# EAGLE design sx-wdec84-1.1 (EAGLE 7.4.0)
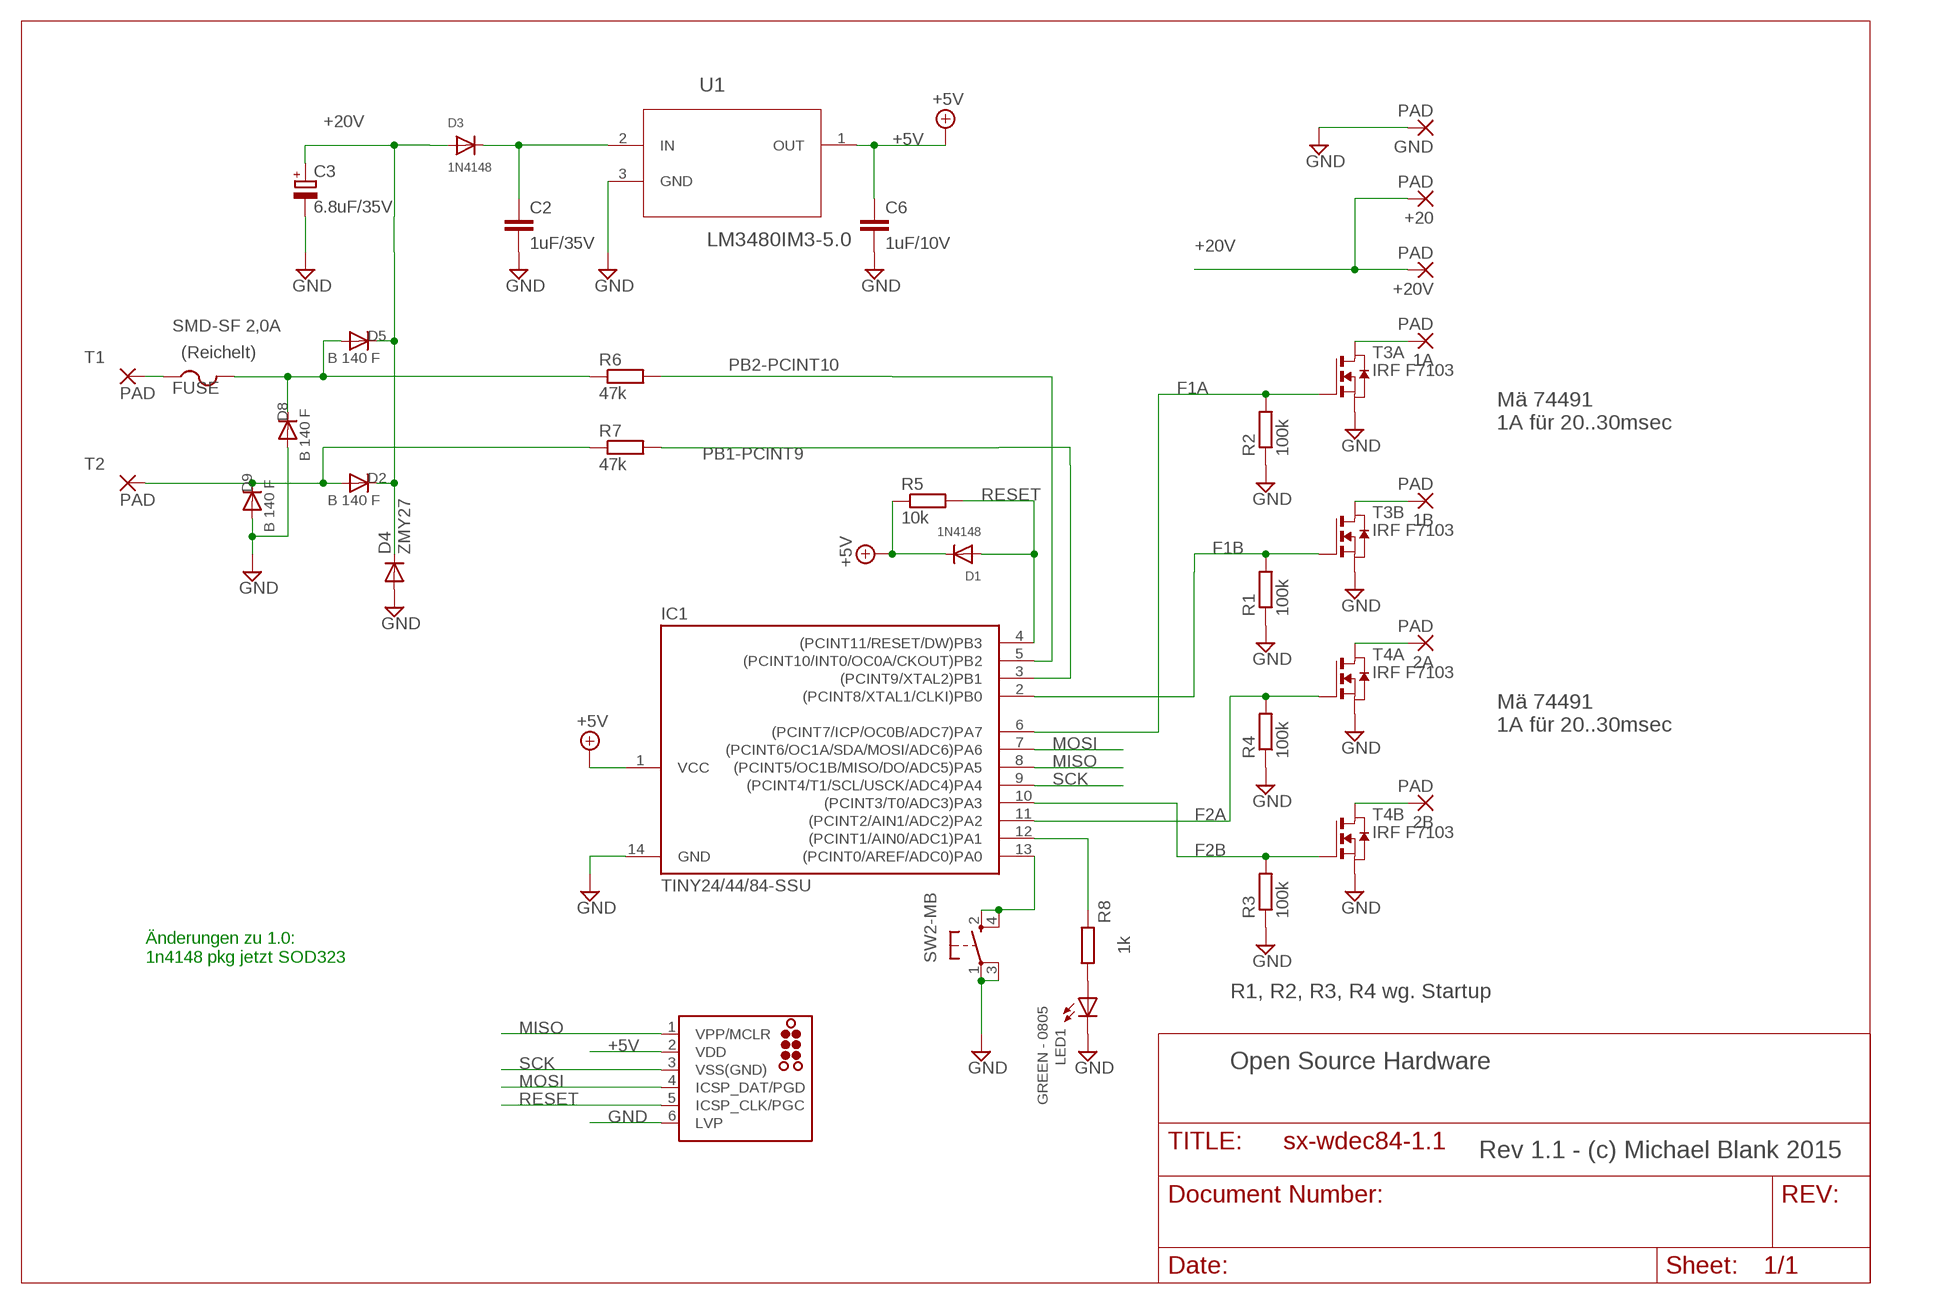
[diagram p0: schematic, sheet 1]

## Parts
1A  PAD  SMD2  [SMD1,27-2,54]
1B  PAD  SMD2  [SMD1,27-2,54]
2A  PAD  SMD2  [SMD1,27-2,54]
2B  PAD  SMD2  [SMD1,27-2,54]
+20  PAD  SMD2  [SMD1,27-2,54]
+20V  PAD  SMD2  [SMD1,27-2,54]
C2  1uF/35V  C-EUC0805  [C0805]
C3  6.8uF/35V  CPOL-EUSMCD  [SMC_D]
C6  1uF/10V  C-EUC0805  [C0805]
D1  1N4148  DIODESOD-323F  [SOD-323F]
D2  B 140 F  DIODESMA-403D  [SMA-403D]
D3  1N4148  DIODESOD-323F  [SOD-323F]
D4  ZMY27  DIODE-MELF-MLL41  [MELF-MLL41]
D5  B 140 F  DIODESMA-403D  [SMA-403D]
D8  B 140 F  DIODESMA-403D  [SMA-403D]
D9  B 140 F  DIODESMA-403D  [SMA-403D]
FUSE  SMD-SF 2,0A  PTCFUSE-1812  [1812]
GND  PAD  SMD2  [SMD1,27-2,54]
IC1  TINY24/44/84-SSU  [SOIC14]
J1  ISP  TC2030-MCP-NL  [TC2030-MCP-NL]
LED1  GREEN - 0805  LED0805  [LED-0805]
R1  100k  R-EU_R0805W  [R0805W]
R2  100k  R-EU_R0805W  [R0805W]
R3  100k  R-EU_R0805W  [R0805W]
R4  100k  R-EU_R0805W  [R0805W]
R5  10k  R-EU_R0805W  [R0805W]
R6  47k  R-EU_R0805W  [R0805W]
R7  47k  R-EU_R0805W  [R0805W]
R8  1k  R-EU_R0805W  [R0805W]
SW2-MB  SPST_TACT-KMR2  [KMR2]
T1  PAD  SMD2  [SMD1,27-2,54]
T2  PAD  SMD2  [SMD1,27-2,54]
T3  IRF F7103  DMN3024LSD  [SO8]
T4  IRF F7103  DMN3024LSD  [SO8]
U1  LM3480IM3-5.0  [SOT95P263X110-3N]

## Nets
+5V: C6.1 D1.C IC1.1(VCC) J1.2(VDD) R5.1 U1.1(OUT)
+20V: +20.1(P) +20V.1(P) C3.+ D2.C D3.A D4.C D5.C
F1A: IC1.6((PCINT7/ICP/OC0B/ADC7)PA7) R2.2 T3.2(A:G)
F1B: IC1.2((PCINT8/XTAL1/CLKI)PB0) R1.2 T3.4(B:G)
F2A: IC1.11((PCINT2/AIN1/ADC2)PA2) R4.2 T4.2(A:G)
F2B: IC1.10((PCINT3/T0/ADC3)PA3) R3.2 T4.4(B:G)
GND: C2.2 C3.- C6.2 D4.A D8.A D9.A GND.1(P) IC1.14(GND) J1.6(LVP) LED1.C R1.1 R2.1 R3.1 R4.1 SW2-MB.1(P) SW2-MB.3(P1) T3.1(A:S) T3.3(B:S) T4.1(A:S) T4.3(B:S) U1.3(GND)
MISO: IC1.8((PCINT5/OC1B/MISO/DO/ADC5)PA5) J1.1(VPP/MCLR)
MOSI: IC1.7((PCINT6/OC1A/SDA/MOSI/ADC6)PA6) J1.4(ICSP_DAT/PGD)
N$1: 2B.1(P) T4.5(B:D) T4.6(B:D)
N$2: 2A.1(P) T4.7(A:D) T4.8(A:D)
N$3: FUSE.1 T1.1(P)
N$5: D5.A D8.C FUSE.2 R6.1
N$6: IC1.13((PCINT0/AREF/ADC0)PA0) SW2-MB.2(S) SW2-MB.4(S1)
N$7: C2.1 D3.C U1.2(IN)
N$8: 1B.1(P) T3.5(B:D) T3.6(B:D)
N$9: LED1.A R8.2
N$10: 1A.1(P) T3.7(A:D) T3.8(A:D)
N$12: IC1.12((PCINT1/AIN0/ADC1)PA1) R8.1
PB1-PCINT9: IC1.3((PCINT9/XTAL2)PB1) R7.2
PB2-PCINT10: IC1.5((PCINT10/INT0/OC0A/CKOUT)PB2) R6.2
RESET: D1.A IC1.4((PCINT11/RESET/DW)PB3) J1.5(ICSP_CLK/PGC) R5.2
SCK: IC1.9((PCINT4/T1/SCL/USCK/ADC4)PA4) J1.3(VSS(GND))
TR-L: D2.A D9.C R7.1 T2.1(P)

## Notes on the sheet
- (Reichelt)
- Mä 74491
  1A für 20..30msec
- Mä 74491
  1A für 20..30msec
- Änderungen zu 1.0:
  1n4148 pkg jetzt SOD323
- R1, R2, R3, R4 wg. Startup
- Open Source Hardware
- Rev 1.1 - (c) Michael Blank 2015

## Library data of the parts
1A 1B 2A 2B +20 +20V GND T1 T2 = wirepad:SMD2: SMD PAD
C2 C6 = rcl:C-EU: CAPACITOR, European symbol
C3 = resistor:CPOL-EU: POLARIZED CAPACITOR, European symbol
D1 D3 = adafruit:DIODE: Diode SMADIODE - SMA Surface Mount Package 20V 1A Schottky Diode Digikey: 641-1014-6-ND DO-1N4148 - Through Hole Small Current Diode SOD-123 20V 1 A (.5mV Vf) Schottky Diode - Digikey: MBRX120TPMSCT-ND SOD-323 10V 570mA (.38mV Vf, 3ns) Schottky Diode - Digikey: ZLLS410CT-ND SOD-523 30V 30mA Schottky Diode (RB751S-40TE61) - Digikey: RB751S-40TE61CT-ND SOT23-R/W - SOT23 Package (R = Solder Paste/Reflow Ovens, W = Hand-Soldering) BAT54Film 40V 300mA - Digikey: 497-7162-1-ND
D2 D5 D8 D9 = Ai_DiscreteSemis:DIODE
D4 = diode:DIODE-: DIODE
FUSE = adafruit:PTCFUSE: PTC fuses, resettable thermistors
IC1 = avr-7:TINY24/44/84
J1 = tag-connect:TC2030: TAG-CONNECT ICSP Connector Manufacturer: Tag-Connect <http://www.tag-connect.com> Cable for easy In-Circuit Serial Programming. Designed for Microchip ICD2, suitable for many others. Two variants - one "with legs" (for hands-free fit on PCB) and another "without legs" for quick programming. PAD Description 1 MCLR/Vpp 2 Vdd 3 GND 4 PGD (ISPDAT) 5 PGC (ISPCLK) 6 nc (used for LVP) ©2009 ROFA.cz - modified and updated by Robert Darlington ‹rdarlington@gmail.com›
LED1 = Ai_LED:LED
R1-R8 = rcl:R-EU_: RESISTOR, European symbol
SW2-MB = adafruit_MB:SPST_TACT: SMT 6mm switch, EVQQ2 series http://www.ladyada.net/library/eagle
T3 T4 = zetex:DMN3024LSD: 30V DUAL N-CHANNEL ENHANCEMENT MODE MOSFET Source: Data sheet <http://www.diodes.com/datasheets/DMN3024LSD.pdf>; OC_FARNELL: unknown; OC_NEWARK: unknown
U1 = lm3480:LM3480IM3-5.0: Linear Voltage Regulator; MPN: LM3480IM3-50; OC_FARNELL: 3160634; OC_NEWARK: 83F3816; PACKAGE: SOT-23-3; SUPPLIER: National Semiconductors

## Board
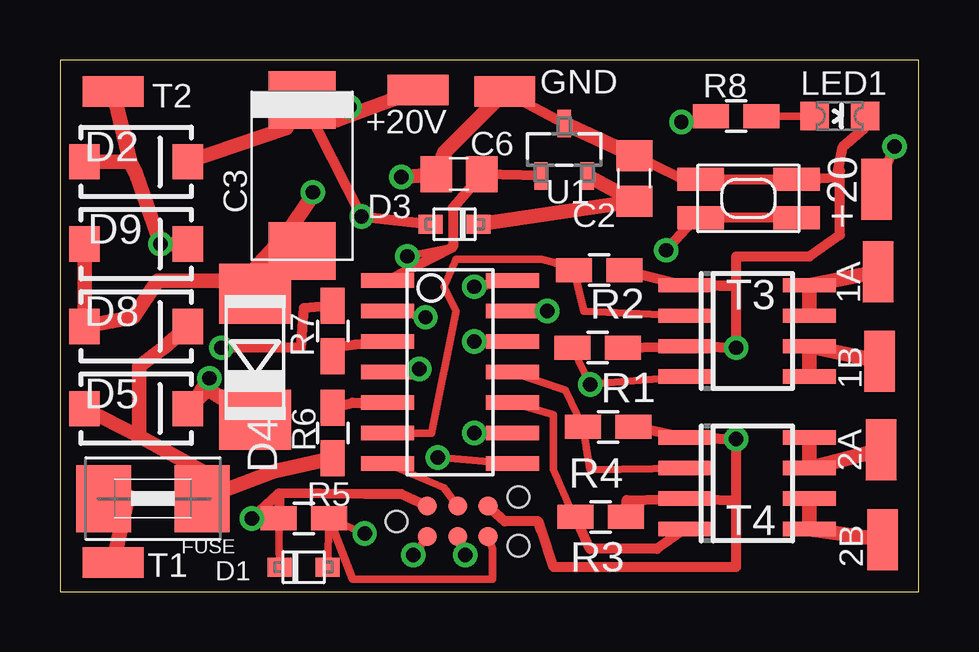
[diagram p1: board, top side]
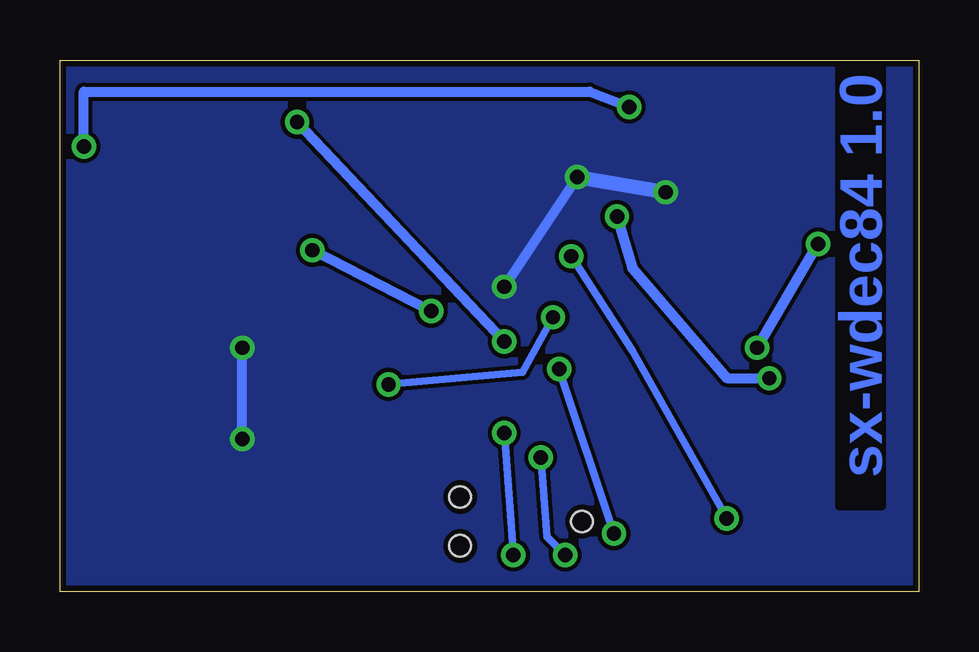
[diagram p2: board, bottom side, seen from below]

Size 35.79 x 22.15 mm. Coordinates in mm from the lower left corner, seen from the top.
Outline: 0,0 35.79,0 35.79,22.15 0,22.15 0,0
Copper layers (1*16): Top 0.035mm / dielectric 1.55mm / Bottom 0.035mm
Design rules "eC_2Layer_PClass6_BaseCopperO35": minimum track width 0.15mm, minimum drill 0.35mm, track to track 0.175mm, track to pad 0.175mm, pad to pad 0.175mm, via to via 0.175mm, smd to smd 0mil, copper to edge 0.25mm, drill to drill 0.35mm, minimum pad ring 0.175mm, minimum via ring 0.125mm, stop-mask expansion 0mil, vias tented up to drill 0.45mm, thermal gap 0.2mm

### Footprints (pad centres in the part's own frame; a part is rotated, then mirrored left to right if it is on the bottom)
SMD1,27-2,54 = smd 1.27 x 2.54: 1 0,0
C0805 = smd 1.3 x 1.5: 1 -0.95,0; 2 0.95,0
SMC_D = smd 2.4 x 2.8: + -3.15,0; - 3.15,0
SOD-323F = smd 1 x 0.8: A -1,0; C 1,0
SMA-403D = smd 1.27 x 1.47: A -2.15,0; C 2.15,0
MELF-MLL41 = smd 2.5 x 3: A 2.625,0; C -2.625,0
1812 = smd 2.286 x 2.794: 1 -2.046,0; 2 2.046,0
SOIC14 = smd 0.61 x 2.21: 1 -3.81,-2.603; 2 -2.54,-2.603; 3 -1.27,-2.603; 4 0,-2.603; 5 1.27,-2.603; 6 2.54,-2.603; 7 3.81,-2.603; 8 3.81,2.603; 9 2.54,2.603; 10 1.27,2.603; 11 0,2.603; 12 -1.27,2.603; 13 -2.54,2.603; 14 -3.81,2.603
TC2030-MCP-NL = smd 0.787 x 0.787: 1 1.27,-0.635; 2 1.27,0.635; 3 2.54,-0.635; 4 2.54,0.635; 5 3.81,-0.635; 6 3.81,0.635 | hole 0.889: 0,0; 5.08,-1.016; 5.08,1.016
LED-0805 = smd 1.2 x 1.2: A 0,-1.05; C 0,1.05
R0805W = smd 1.5 x 1: 1 -1.052,0; 2 1.052,0
KMR2 = smd 1.93 x 0.965: 1 2,0.8; 2 2,-0.8; 3 -2,0.8; 4 -2,-0.8
SO8 = smd 0.6 x 2.2: 1 -1.905,-2.6; 2 -0.635,-2.6; 3 0.635,-2.6; 4 1.905,-2.6; 5 1.905,2.6; 6 0.635,2.6; 7 -0.635,2.6; 8 -1.905,2.6
SOT95P263X110-3N = smd 0.559 x 1.143: 1 -0.965,-1.092; 2 0.965,-1.092; 3 0,1.092

### Placement (x,y rotation side)
1A  34.1,13.34 180 top
1B  34.16,9.59 180 top
2A  34.23,5.91 0 top
2B  34.29,2.16 0 top
+20  34.04,16.76 0 top
+20V  14.92,20.89 90 top
C2  23.94,17.21 90 top
C3  10.1,17.34 270 top
C6  16.64,17.4 180 top
D1  10.16,1.02 180 top
D2  3.18,17.91 0 top
D3  16.45,15.3 0 top
D4  8.13,9.78 90 top
D5  3.18,7.62 0 top
D8  3.18,11.05 0 top
D9  3.18,14.48 0 top
FUSE  3.87,3.87 0 top
GND  18.54,20.83 270 top
IC1  16.26,9.14 270 top
J1  14.03,2.92 0 top
LED1  32.51,19.81 270 top
R1  22.42,10.16 180 top
R2  22.48,13.4 180 top
R3  22.54,3.11 180 top
R4  22.86,6.86 180 top
R5  10.16,3.05 0 top
R6  11.37,6.6 90 top
R7  11.37,10.86 270 top
R8  28.19,19.81 0 top
SW2-MB  28.7,16.38 0 top
T1  2.22,1.21 90 top
T2  2.22,20.83 90 top
T3  28.64,10.86 270 top
T4  28.64,4.51 270 top
U1  21.02,18.41 0 top

### Tracks (layer width: path | path; a pad name or v marks a point on that pad's centre or on a via)
+5V  (via drill 0.6 pad 1.02)
  Top 0.305: 16.38,14.35 v14.48,13.97 | R5.1 D1.C
  Top 0.406: U1.1 C6.1 16.38,16 16.38,14.35 IC1.1 | J1.2 14.22,4.06 12.7,4.06 9.13,4.09 | 9.13,4.09 9.14,4.06 R5.1 | v8,3.05 9.13,4.09
  Bottom 0.305: v14.48,13.97 11.94,10.03 v8,3.05
+20V  (via drill 0.6 pad 1.02)
  Top 0.406: C3.+ v12.57,15.62 | v12.57,15.62 D3.A v12.57,15.62 | v6.22,8.89 6.1,8.89 D5.C | +20.1 v34.8,18.54 | v12.07,20.19 11.53,19.64
  Top 0.61: +20V.1 11.53,19.64 C3.+ 9.42,19.3 D2.C | D4.C 6.17,8.42 D5.C
  Bottom 0.406: v12.57,15.62 11.94,13.46 8,8.89 v6.22,8.89 | v34.8,18.54 34.8,20.83 13.72,20.83 v12.07,20.19
F1A
  Top 0.305: IC1.6 15.49,6.6 16.51,11.68 16,12.7 16.51,13.84 16.89,13.84 20.07,13.84 20.57,13.72 R2.2 21.84,11.68 T3.2
F1B  (via drill 0.6 pad 1.02)
  Top 0.305: IC1.2 v15.24,11.43 | R1.2 v22.1,8.64 T3.4
  Bottom 0.305: v15.24,11.43 16.51,9.14 v22.1,8.64
F2A
  Top 0.305: IC1.11 21.08,8.38 R4.2 22.1,5.08 T4.2
F2B
  Top 0.305: R3.2 21.34,3.3 20.57,5.08 20.57,7.37 IC1.10
  Top 0.406: T4.4 24.89,1.78 22.1,1.78 R3.2
GND  (via drill 0.6 pad 1.02)
  Top 0.406: J1.6 18.54,2.92 19.94,2.92 20.07,2.54 20.57,1.02 28.19,1.02 28.19,3.81 | R3.1 23.62,3.11 23.62,3.81 T4.3 28.19,3.81 | 28.19,3.81 v28.19,6.35 | v28.19,6.35 T4.1 | T4.1 R4.1 | T4.1 v28.19,6.35 | v28.19,10.16 T3.3 | T3.1 28.19,12.76 28.19,13.97 31.24,13.97 32.51,14.86 32.51,16.76 32.51,17.53 32.38,17.27 | T3.3 v28.19,10.16 | v28.19,10.16 28.19,12.7 T3.1 | R1.1 T3.3 | R2.1 T3.1 | LED1.C 33.53,19.3 32.64,18.54 32.38,17.27 | GND.1 U1.3 | C2.2 25.78,17.27 26.99,17.27 SW2-MB.3 SW2-MB.1 31.03,17.18 32.38,17.27 | IC1.14 v17.27,12.7
  Top 0.61: C3.- 9.49,14.97 | 9.49,14.97 10.51,16.47 v10.54,16.64 | U1.3 C2.2 | GND.1 16,18.29 C6.2 v14.22,17.27 | D9.A D8.A 3.05,11.43 4.06,12.95 6.99,12.95 | 6.99,12.95 7.62,12.95 7.87,13.21 9.4,14.88 9.49,14.97 | D4.A 7.54,12.4 6.99,12.95
  Bottom 0.406: v28.19,6.35 v28.19,10.16 | v17.27,12.7 v14.22,17.27
  Bottom 0.61: v14.22,17.27 v10.54,16.64
  pour Bottom: 0.25,21.84 0.25,0.25 35.56,0.25 35.56,21.84
MISO  (via drill 0.6 pad 1.02)
  Top 0.305: IC1.8 v15.75,5.59 | v14.73,1.52 J1.1
  Bottom 0.305: v15.75,5.59 15.49,2.29 v14.73,1.52
MOSI
  Top 0.305: IC1.7 16,4.32 J1.4
N$1
  Top 0.61: 2B.1 T4.5 T4.6
N$2
  Top 0.61: 2A.1 T4.7 T4.8
N$3
  Top 0.61: T1.1 2.84,4 FUSE.1
N$5
  Top 0.61: R6.1 8.95,5.02 FUSE.2 6.43,4.75 3.3,6.48 | 3.3,6.48 D5.A | D8.C 5.21,10.92 4.32,10.16 3.3,9.4 3.3,6.48
N$6  (via drill 0.6 pad 1.02)
  Top 0.406: IC1.13 v20.32,11.68 | SW2-MB.2 SW2-MB.4 26.7,15.78 v25.27,14.22
  Bottom 0.406: v20.32,11.68 v25.27,14.22
N$7
  Top 0.61: D3.C C2.1 U1.2
N$8
  Top 0.61: 1B.1 T3.6 T3.5
N$9
  Top 0.305: R8.2 LED1.A
N$10
  Top 0.61: T3.7 T3.8 1A.1
N$12  (via drill 0.6 pad 1.02)
  Top 0.406: IC1.12 v17.27,10.41 | v25.91,19.56 R8.1
  Bottom 0.406: v17.27,10.41 v25.91,19.56
PB1-PCINT9
  Top 0.406: IC1.3 12.32,10.29 11.43,10.16 R7.2
PB2-PCINT10
  Top 0.406: R6.2 12.19,7.87 IC1.5
RESET  (via drill 0.6 pad 1.02)
  Top 0.305: R5.2 12.19,0.51 18.03,0.51 18.03,1.78 J1.5 | IC1.4 v14.99,9.27 | v12.7,2.41 R5.2 | R5.2 D1.A
  Bottom 0.305: v14.99,9.27 v12.7,2.41
SCK  (via drill 0.6 pad 1.02)
  Top 0.305: J1.3 v16.89,1.52
  Top 0.406: IC1.9 v17.27,6.6
  Bottom 0.305: v16.89,1.52 v17.27,6.6
TR-L  (via drill 0.6 pad 1.02)
  Top 0.406: R7.1 10.16,11.81 10.03,10.16 v6.73,10.16
  Top 0.61: T2.1 2.93,17.91 | 2.93,17.91 D2.A | 2.93,17.91 3.18,17.4 v4.19,14.48 D9.C
  Bottom 0.406: v6.73,10.16 v4.19,14.48

### Text on the board
Bottom: sx-wdec84 1.0